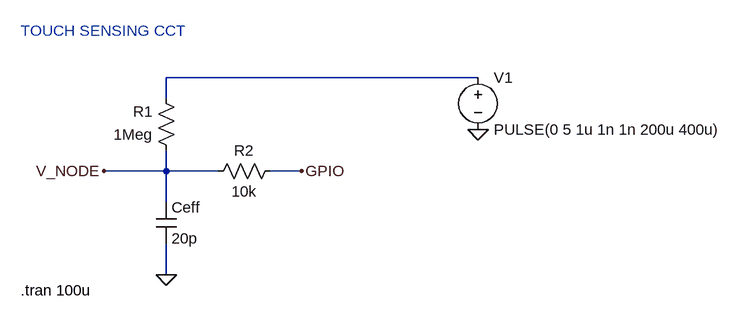
[diagram p0: schematic Touch_Sensing.asc]
Touch_Sensing.asc, the LTspice schematic file:
Version 4.1
SHEET 1 1072 680
WIRE 672 256 192 256
WIRE 192 288 192 256
WIRE 192 400 192 368
WIRE 192 400 96 400
WIRE 272 400 192 400
WIRE 400 400 352 400
WIRE 192 448 192 400
WIRE 192 560 192 512
FLAG 192 560 0
FLAG 400 400 GPIO
FLAG 672 336 0
FLAG 96 400 V_NODE
SYMBOL res 208 384 R180
WINDOW 0 36 76 Left 2
WINDOW 3 36 40 Left 2
SYMATTR InstName R1
SYMATTR Value 1Meg
SYMBOL cap 176 448 R0
SYMATTR InstName Ceff
SYMATTR Value 20p
SYMBOL voltage 672 240 R0
WINDOW 123 0 0 Left 0
WINDOW 39 0 0 Left 0
SYMATTR InstName V1
SYMATTR Value PULSE(0 5 1u 1n 1n 200u 400u)
SYMBOL res 368 384 R90
WINDOW 0 0 56 VBottom 2
WINDOW 3 32 56 VTop 2
SYMATTR InstName R2
SYMATTR Value 10k
TEXT -32 184 Left 2 ;TOUCH SENSING CCT
TEXT -32 584 Left 2 !.tran 100u

The netlist it stands for:
* Touch_Sensing.asc
R1 V_NODE N001 1Meg
Ceff V_NODE 0 20p
V1 N001 0 PULSE(0 5 1u 1n 1n 200u 400u)
R2 GPIO V_NODE 10k
* TOUCH SENSING CCT
.tran 100u
.backanno
.end